# EAGLE board AQ_sensor_GSM (EAGLE 9.6.2), part 1 of 2
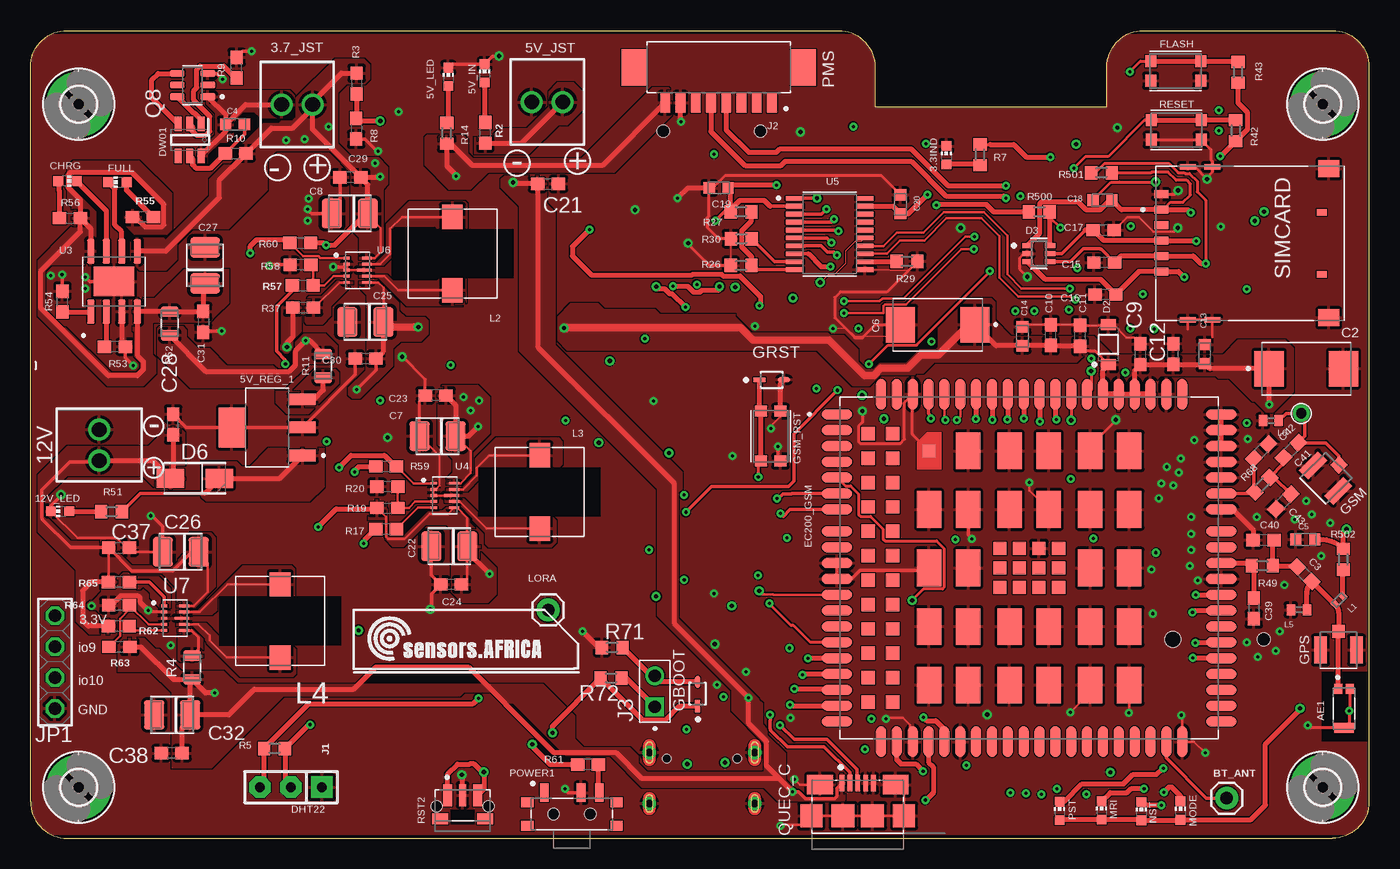
[diagram p8: board, top side]
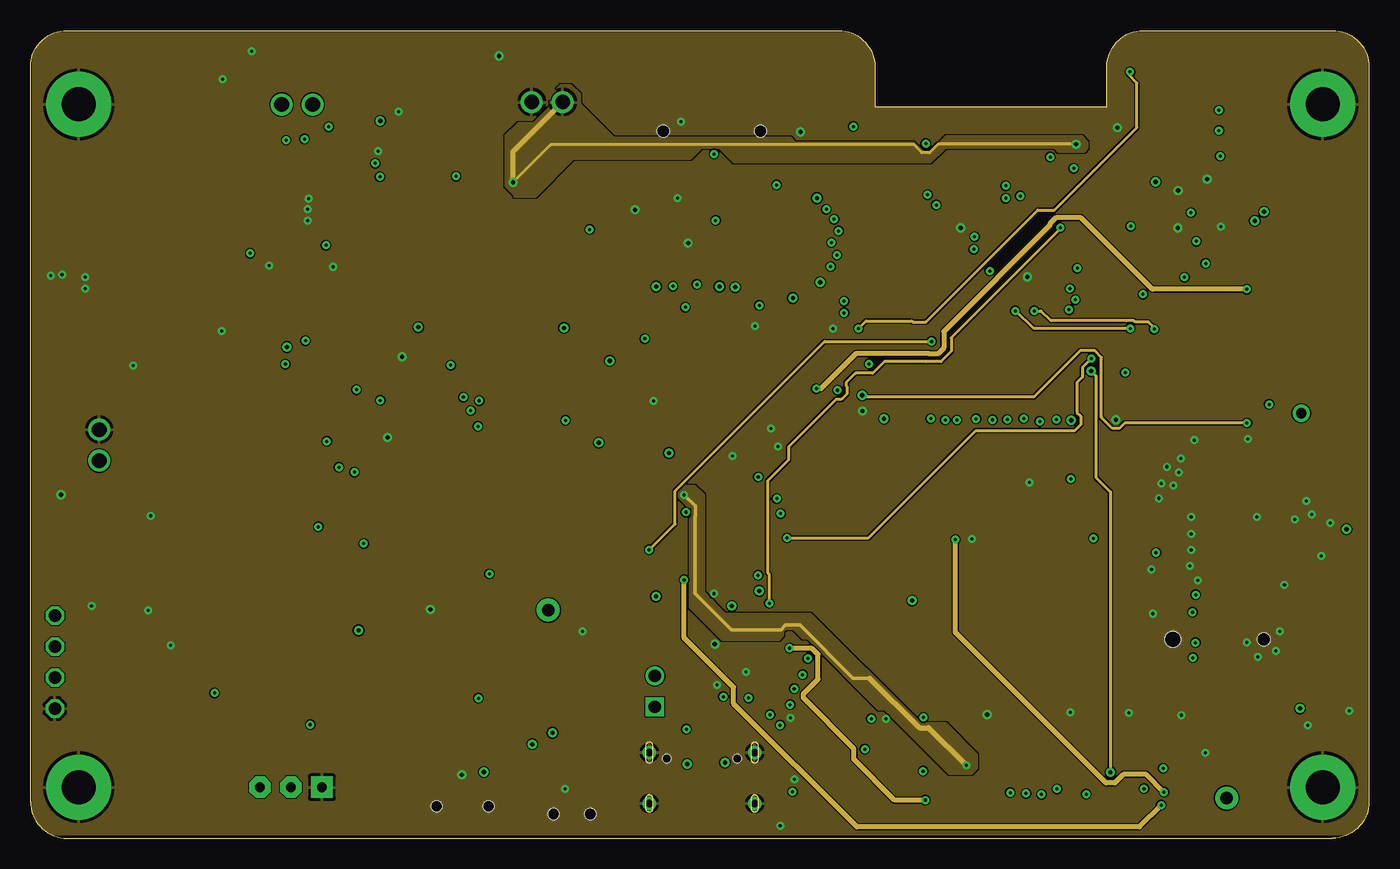
[diagram p9: board, inner layer GND]
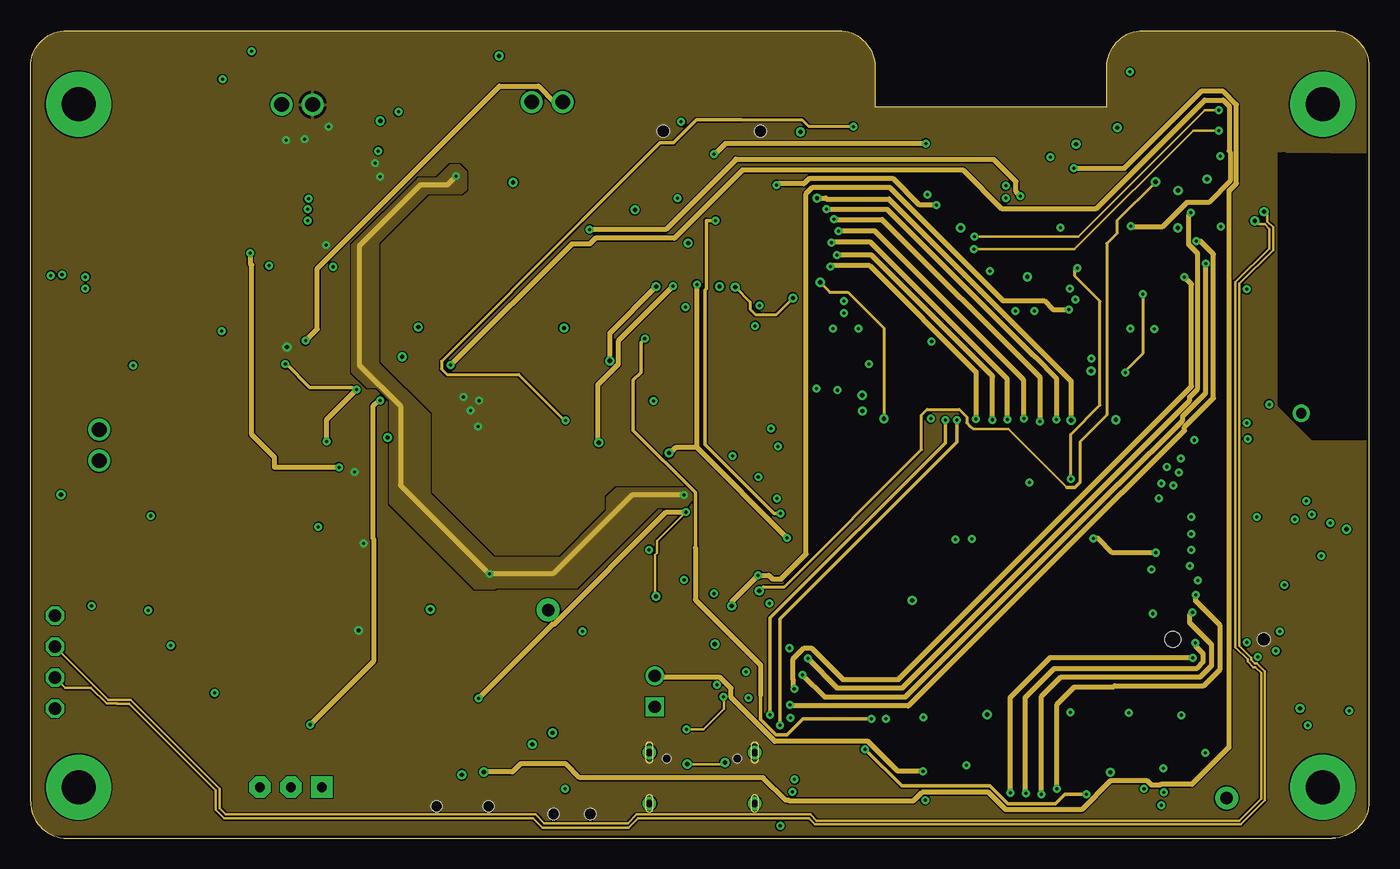
[diagram p10: board, inner layer V_LIPO]
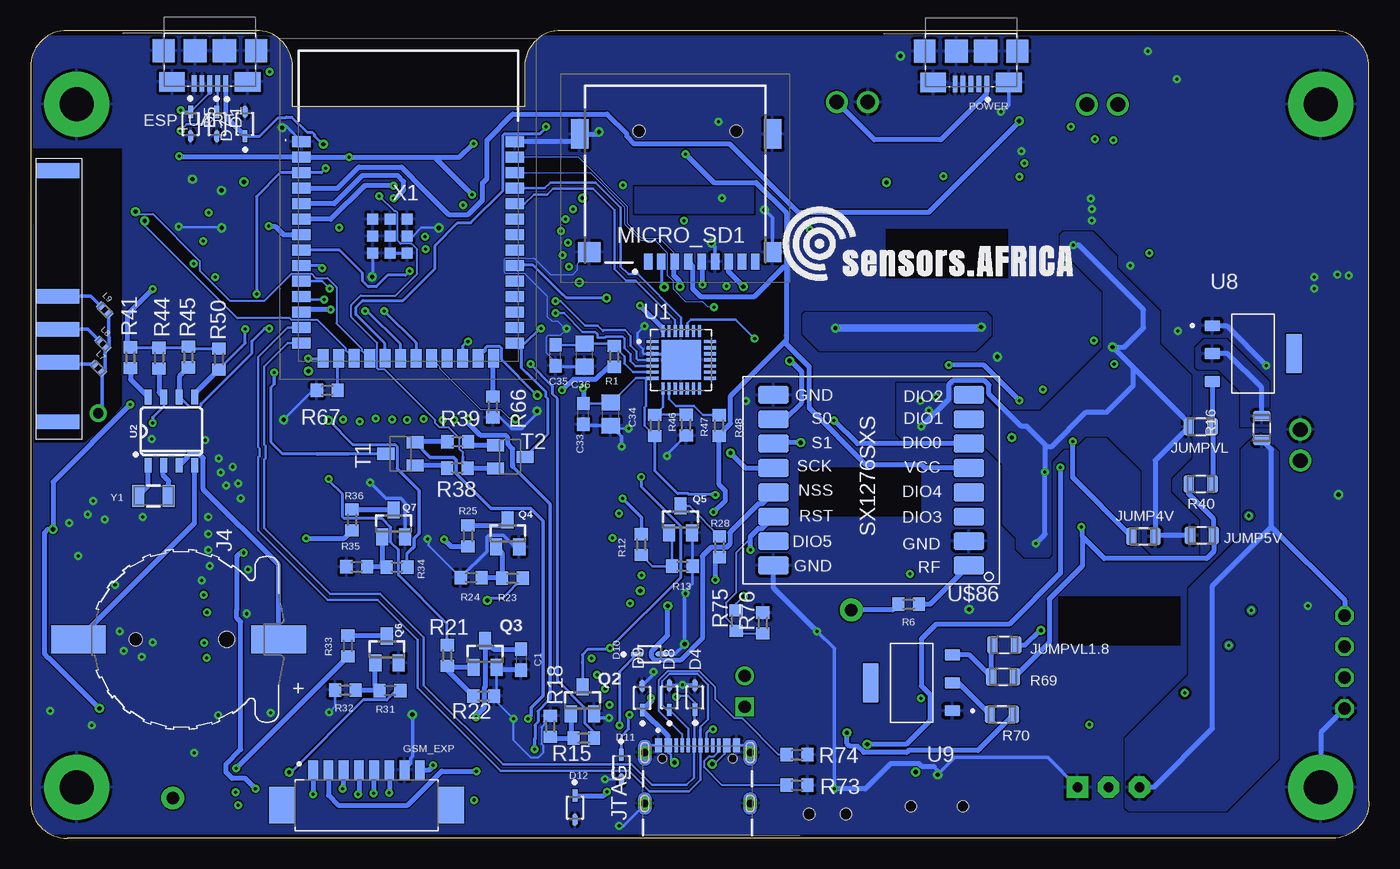
[diagram p11: board, bottom side, seen from below]

Size 109.75 x 66.25 mm. Coordinates in mm from the lower left corner, seen from the top.
Outline: 109.75,63.25 109.75,3 arc-90 106.75,0 3,0 arc-90 0,3 0,63.25 arc-90 3,66.25 66.25,66.25 arc-90 69.25,63.25 69.25,60 88.25,60 88.25,63.25 arc-90 91.25,66.25 106.75,66.25 arc-90 109.75,63.25
Copper layers (1+2*15+16): Top 0.035mm / dielectric 1.5mm / GND 0.035mm / dielectric 0.15mm / V_LIPO 0.035mm / dielectric 0.2mm / Bottom 0.035mm
Design rules "default *": minimum track width 0.1mm, minimum drill 0.15mm, track to track 0.1mm, track to pad 0.1mm, pad to pad 0.2mm, via to via 0.3mm, smd to smd 0.3mm, copper to edge 0.05mm, drill to drill 0.3mm, minimum pad ring 10mil, minimum via ring 8mil, stop-mask expansion 4mil, vias tented up to drill 0mil, thermal gap 10mil
Net classes: 0 default: width 0.1 mm, drill 0.2 mm, clearance 0.1 mm; 1 POWER: width 0.2 mm, drill 0.2 mm, clearance 0.2 mm to class 0, clearance 0.2 mm; 2 BGA: width 0.1 mm, drill 0.2 mm; 3 HCurrent: width 0.2 mm, drill 0.2 mm, clearance 0.2 mm to class 0; 4 Antenna: width 0.3 mm, drill 0.2 mm, clearance 0.3 mm to class 0

## Footprints (pad centres in the part's own frame; a part is rotated, then mirrored left to right if it is on the bottom)
CHIP-LED0603 = smd 0.8 x 0.8: A 0,-0.75; C 0,0.75
TERMBLK_254-2N = drill 1.2: 1 -1.27,0; 2 1.27,0
VREG_LM7805MPX/NOPB = smd 2.15 x 0.95: 1 -2.9,2.3; 2 -2.9,0; 3 -2.9,-2.3 | smd 2.15 x 3.25: 4 2.9,0
XDCR_W3011 = smd 0.65 x 0.8: 1 -0.475,1.6; 2 0.475,1.6 | smd 1.6 x 0.8: 3 0,-1.6
1X01 = drill 1.016 pad 1.88: 1 0,0
0603 = smd 1.1 x 1: 1 -0.85,0; 2 0.85,0
CAP_20TQC100MYF = smd 2.4 x 2.9: 1 -3.05,0; 2 3.05,0
CAPC1608X90N = smd 0.92 x 0.98: 1 -0.775,0; 2 0.775,0
CAP_TANT_B = smd 1.66 x 2.42: 1 -1.475,0; 2 1.475,0
C0603 = smd 1.1 x 1: 1 -0.85,0; 2 0.85,0
C0805 = smd 1.3 x 1.5: 1 -0.95,0; 2 0.95,0
ON_SEMI_1N4148WS_0 = smd 1.006 x 0.392: 1 -1,0; 2 1,0
ON_SEMICONDUCTOR_MMSZ5231BT1G_0 = smd 0.91 x 1.22: 1 -1.635,0; 2 1.635,0
SEMTECH_SMF05C_0 = smd 0.85 x 0.4: 1 -0.925,0.65; 2 -0.925,0; 3 -0.925,-0.65; 4 0.925,-0.65; 5 0.925,0; 6 0.925,0.65
DIOM5025X220N = smd 2.25 x 1.55: 1 -2,0; 2 2,0
SOT23-6L = smd 0.55 x 1.2: 1 -0.95,-1.3; 2 0,-1.3; 3 0.95,-1.3; 4 0.95,1.3; 5 0,1.3; 6 -0.95,1.3
XCVR_EC200UCNAB-N05-SNNSA = smd 2.5 x 0.8: 1 -15.75,12.6; 2 -15.75,11.3; 3 -15.75,10; 4 -15.75,8.7; 5 -15.75,7.4; 6 -15.75,6.1; 7 -15.75,4.8; 8 -15.75,0.4; 9 -15.75,-0.9; 10 -15.75,-2.2; 11 -15.75,-3.5; 12 -15.75,-4.8; 13 -15.75,-6.1; 14 -15.75,-7.4; 15 -15.75,-8.7; 16 -15.75,-10; 17 -15.75,-11.3; 18 -15.75,-12.6; 37 15.75,-12.6; 38 15.75,-11.3; 39 15.75,-10; 40 15.75,-8.7; 41 15.75,-7.4; 42 15.75,-6.1; 43 15.75,-4.8; 44 15.75,-3.5; 45 15.75,-2.2; 46 15.75,-0.9; 47 15.75,0.4; 48 15.75,4.8; 49 15.75,6.1; 50 15.75,7.4; 51 15.75,8.7; 52 15.75,10; 53 15.75,11.3; 54 15.75,12.6; 141 -15.75,3; 142 -15.75,1.7; 143 15.75,1.7; 144 15.75,3 | smd 0.8 x 2.5: 19 -9.55,-14.25; 20 -8.25,-14.25; 21 -6.95,-14.25; 22 -5.65,-14.25; 23 -4.35,-14.25; 24 -3.05,-14.25; 25 -1.75,-14.25; 26 -0.45,-14.25; 27 0.85,-14.25; 28 2.15,-14.25; 29 3.45,-14.25; 30 4.75,-14.25; 31 6.05,-14.25; 32 7.35,-14.25; 33 8.65,-14.25; 34 9.95,-14.25; 35 11.25,-14.25; 36 12.55,-14.25; 55 12.55,14.25; 56 11.25,14.25; 57 9.95,14.25; 58 8.65,14.25; 59 7.35,14.25; 60 6.05,14.25; 61 4.75,14.25; 62 3.45,14.25; 63 2.15,14.25; 64 0.85,14.25; 65 -0.45,14.25; 66 -1.75,14.25; 67 -3.05,14.25; 68 -4.35,14.25; 69 -5.65,14.25; 70 -6.95,14.25; 71 -8.25,14.25; 72 -9.55,14.25; 113 -10.85,14.25; 114 -12.15,14.25; 115 -10.85,-14.25; 116 -12.15,-14.25 | smd 1.1 x 1.1: 73 2.4,1.6; 74 2.4,0; 75 2.4,-1.6; 76 0.8,1.6; 77 0.8,0; 78 0.8,-1.6; 79 -0.8,1.6; 80 -0.8,0; 81 -0.8,-1.6; 82 -2.4,1.6; 83 -2.4,0; 84 -2.4,-1.6; 117 -11.2,11; 118 -11.2,9; 119 -11.2,7; 120 -11.2,5; 121 -11.2,3; 122 -11.2,1; 123 -11.2,-1; 124 -11.2,-3; 125 -11.2,-5; 126 -11.2,-7; 127 -11.2,-9; 128 -11.2,-11; 129 -13.2,11; 130 -13.2,9; 131 -13.2,7; 132 -13.2,5; 133 -13.2,3; 134 -13.2,1; 135 -13.2,-1; 136 -13.2,-3; 137 -13.2,-5; 138 -13.2,-7; 139 -13.2,-9; 140 -13.2,-11 | smd 2 x 3: 85 8.2,9.6; 86 8.2,4.8; 87 8.2,0; 88 8.2,-4.8; 89 8.2,-9.6; 90 5,9.6; 91 5,4.8; 92 5,0; 93 5,-4.8; 94 5,-9.6; 95 1.6,9.6; 96 1.6,4.8; 97 1.6,-4.8; 98 1.6,-9.6; 99 -1.6,9.6; 100 -1.6,4.8; 101 -1.6,-4.8; 102 -1.6,-9.6; 103 -5,9.6; 104 -5,4.8; 105 -5,0; 106 -5,-4.8; 107 -5,-9.6; 109 -8.2,4.8; 110 -8.2,0; 111 -8.2,-4.8; 112 -8.2,-9.6 | smd 1 x 1: 108 -8.2,9.6
AMPHENOL_10118192-0001LF = smd 0.4 x 1.35: 1 -1.3,0; 2 -0.65,0; 3 0,0; 4 0.65,0; 5 1.3,0 | smd 2.1 x 1.6: SH1 -3.1,-0.125; SH2 3.1,-0.125 | smd 1.8 x 1.9: SH3 -3.8,-2.675; SH6 3.8,-2.675 | smd 1.9 x 1.9: SH4 -1.2,-2.675; SH5 1.2,-2.675
SW_KMR621NGLFS = smd 0.9 x 1: 1_1 -2.05,0.8; 1_2 2.05,0.8; 2_1 -2.05,-0.8; 2_2 2.05,-0.8
TE_1909763-1 = smd 1 x 1.05: 1 0,-1.525 | smd 1.05 x 2.2: 2 -1.475,0; 3 1.475,0
MOLEX_53261-0871 = smd 0.8 x 1.6: 1 -4.375,2.9; 2 -3.125,2.9; 3 -1.875,2.9; 4 -0.625,2.9; 5 0.625,2.9; 6 1.875,2.9; 7 3.125,2.9; 8 4.375,2.9 | smd 2.1 x 3: S1 -6.925,0; S2 6.925,0
2,8-PAD = drill 2.8 pad 5.334: B2,8 0,0
SIP-100-03-32 = drill 0.813 pad 1.778 square: 1 -2.54,0 | drill 0.813 pad 1.778 octagon: 2 0,0; 3 2.54,0
CONNFLY_DS1021-1X2SF162-B = drill 1.02 square: 1 -1.27,0 | drill 1.02: 2 1.27,0
HARWIN_S8411-45R = smd 2.3 x 4.5: N 0,8.425; P 0,-7.975 | hole 1.05: 0,3.725 | hole 1.3: 0,-3.725
1X04 = drill 1.016 octagon: 1 -3.81,0; 2 -1.27,0; 3 1.27,0; 4 3.81,0
GCT_USB4105GFA120 = smd 0.6 x 1.15: A1_B12 -3.2,4.755; A4_B9 -2.4,4.755; B1_A12 3.2,4.755; B4_A9 2.4,4.755 | smd 0.3 x 1.15: A5 -1.25,4.755; A6 -0.25,4.755; A7 0.25,4.755; A8 1.25,4.755; B5 1.75,4.755; B6 0.75,4.755; B7 -0.75,4.755; B8 -1.75,4.755 | drill 0.6 pad 1: SH1 -4.32,4.18; SH2 4.32,4.18; SH3 -4.32,0; SH4 4.32,0 | hole 0.65: 2.89,3.68; -2.89,3.68
RES_0805 = smd 0.87 x 1.42: 1 -0.975,0; 2 0.975,0
INDC1005X60N = smd 0.51 x 0.63: 1 -0.46,0; 2 0.46,0
784778010 = smd 1.7 x 2: 1 0,3; 2 0,-3
INDC1005X45 = smd 0.7 x 0.9: 1 -0.65,0; 2 0.65,0
TF-01A = smd 0.7 x 1.3: 1 2.23,7.174; 2 1.13,7.174; 3 0.03,7.174; 4 -1.07,7.174; 5 -2.17,7.174; 6 -3.27,7.174; 7 -4.37,7.174; 8 -5.47,7.174; CD1 -6.57,7.174 | smd 1.448 x 1.651: MP1 -7.989,6.4 | smd 1.448 x 2.438: MP2 -7.989,-3.3; MP3 7.836,-3.3 | smd 1.854 x 1.651: MP4 7.061,6.4 | hole 1: -5.004,-3.531; 2.972,-3.531
SW_PCM12SMTR = smd 0.7 x 1.5: 1 -2.25,1.75; 2 0.75,1.75; 3 2.25,1.75 | smd 1 x 0.8: S1 -3.65,0.965; S2 -3.65,-0.965; S3 3.65,-0.965; S4 3.65,0.965 | hole 0.9: -1.5,0; 1.5,0
SOT23-BEC = smd 1 x 1.4: B -0.95,-1.1; C 0,1.1; E 0.95,-1.1
SOT95P280X145-6N = smd 1.21 x 0.59: 1 -1.255,0.95; 2 -1.255,0; 3 -1.255,-0.95; 4 1.255,-0.95; 5 1.255,0; 6 1.255,0.95
R0603 = smd 1 x 1.1: 1 -0.85,0; 2 0.85,0
SW_SKRTLAE010 = smd 0.75 x 1.8: 1 -1.225,0.9; 3 1.225,0.9 | smd 0.6 x 1.8: 2 0,0.9 | smd 1.3 x 0.9: S1 -1.85,-1.05; S2 1.85,-1.05 | hole 0.9: -2.125,0; 2.125,0
MOLEX_78646-3001 = smd 1.15 x 0.65: C1 -7.295,2.755; C2 -7.295,0.215; C3 -7.295,-2.325; C5 -7.295,4.025; C6 -7.295,1.485; C7 -7.295,-1.055 | smd 1.3 x 0.45: G1 -5.125,6.27; G2 -3.125,6.27; G3 -5.125,-6.27; G4 -3.125,-6.27 | smd 1.7 x 1.4: G5 6.435,-6.105; G6 6.435,6.105 | smd 0.8 x 0.54: X1 5.855,2.54; X2 5.855,-2.54
SC59-BEC = smd 1 x 1.4: B -0.95,-1.2; C 0,1.2; E 0.95,-1.2
QFN50P500X500X80-29N = smd 0.99 x 0.27: 1 -2.36,1.5; 2 -2.36,1; 3 -2.36,0.5; 4 -2.36,0; 5 -2.36,-0.5; 6 -2.36,-1; 7 -2.36,-1.5; 15 2.36,-1.5; 16 2.36,-1; 17 2.36,-0.5; 18 2.36,0; 19 2.36,0.5; 20 2.36,1; 21 2.36,1.5 | smd 0.27 x 0.99: 8 -1.5,-2.36; 9 -1,-2.36; 10 -0.5,-2.36; 11 0,-2.36; 12 0.5,-2.36; 13 1,-2.36; 14 1.5,-2.36; 22 1.5,2.36; 23 1,2.36; 24 0.5,2.36; 25 0,2.36; 26 -0.5,2.36; 27 -1,2.36; 28 -1.5,2.36 | smd 3.25 x 3.25: 29 0,0
SO08-0.15 = smd 0.6 x 1.2: 1 -1.905,-2.8; 2 -0.635,-2.8; 3 0.635,-2.8; 4 1.905,-2.8; 5 1.905,2.8; 6 0.635,2.8; 7 -0.635,2.8; 8 -1.905,2.8
SOP127P600X175-9N = smd 1.97 x 0.6: 1 -2.475,1.905; 2 -2.475,0.635; 3 -2.475,-0.635; 4 -2.475,-1.905; 5 2.475,-1.905; 6 2.475,-0.635; 7 2.475,0.635; 8 2.475,1.905 | smd 2.413 x 3.302: 9 0,0
VREG_TPS63802DLAR = smd 0.6 x 0.25: 1 -0.9,1; 2 -0.9,0.5; 3 -0.9,0; 4 -0.9,-0.5; 5 -0.9,-1 | smd 0.9 x 0.25: 6 0.75,-1; 7 0.75,-0.5; 9 0.75,0.5; 10 0.75,1 | smd 1.3 x 0.25: 8 0.55,0
SOP65P640X120-20N = smd 1.57 x 0.41: 1 -2.87,2.925; 2 -2.87,2.275; 3 -2.87,1.625; 4 -2.87,0.975; 5 -2.87,0.325; 6 -2.87,-0.325; 7 -2.87,-0.975; 8 -2.87,-1.625; 9 -2.87,-2.275; 10 -2.87,-2.925; 11 2.87,-2.925; 12 2.87,-2.275; 13 2.87,-1.625; 14 2.87,-0.975; 15 2.87,-0.325; 16 2.87,0.325; 17 2.87,0.975; 18 2.87,1.625; 19 2.87,2.275; 20 2.87,2.925
SOT229P700X180-4N = smd 1.31 x 0.93: 1 -3.345,2.29; 2 -3.345,0; 3 -3.345,-2.29 | smd 1.31 x 3.24: 4 3.345,0
SX1276SXS = smd 2.5 x 1.5: 1.RF 4.42,17.58; 2.GND 4.42,15.58; 3.DIO3 4.42,13.58; 4.DIO4 4.42,11.58; 5.VCC 4.42,9.58; 6.DIO0 4.42,7.58; 7.DIO1 4.42,5.58; 8.DIO2 4.42,3.58; 9.GND 20.42,3.58; 10.S0 20.42,5.58; 11.S1 20.42,7.58; 12.SCK 20.42,9.58; 13.NSS 20.42,11.58; 14.RST 20.42,13.58; 15.DIO5 20.42,15.58; 16.GND 20.42,17.58
GSM_SPRING_ANTENNA = drill 0.85 pad 1.422: 1 0,0
ADCH002_V1 = smd 1.2 x 3.5: 1 1,1.8; 2 11.3,1.8; 3 14,1.8; 4 16.7,1.8; 5 21.6,1.8
ESP32S3WROOM1N8R2 = smd 1.5 x 0.9: 1 -8.75,5.26; 2 -8.75,3.99; 3 -8.75,2.72; 4 -8.75,1.45; 5 -8.75,0.18; 6 -8.75,-1.09; 7 -8.75,-2.36; 8 -8.75,-3.63; 9 -8.75,-4.9; 10 -8.75,-6.17; 11 -8.75,-7.44; 12 -8.75,-8.71; 13 -8.75,-9.98; 14 -8.75,-11.25; 27 8.75,-11.25; 28 8.75,-9.98; 29 8.75,-8.71; 30 8.75,-7.44; 31 8.75,-6.17; 32 8.75,-4.9; 33 8.75,-3.63; 34 8.75,-2.36; 35 8.75,-1.09; 36 8.75,0.18; 37 8.75,1.45; 38 8.75,2.72; 39 8.75,3.99; 40 8.75,5.26 | smd 0.9 x 1.5: 15 -6.985,-12.5; 16 -5.715,-12.5; 17 -4.445,-12.5; 18 -3.175,-12.5; 19 -1.905,-12.5; 20 -0.635,-12.5; 21 0.635,-12.5; 22 1.905,-12.5; 23 3.175,-12.5; 24 4.445,-12.5; 25 5.715,-12.5; 26 6.985,-12.5 | smd 0.9 x 0.9: 41 -1.5,-2.46; 42 -1.5,-1.06; 43 -2.9,-1.06; 44 -2.9,-2.46; 45 -2.9,-3.86; 46 -1.5,-3.86; 47 -0.1,-3.86; 48 -0.1,-2.46; 49 -0.1,-1.06
CRYSTAL-SMD-3.2X1.5MM = smd 1 x 1.8: P$1 -1.25,0; P$2 1.25,0

## Placement (x,y rotation side)
3.3IND  ORANGE  [CHIP-LED0603]  75.09,56.02 0 top
3.7_JST  2828XX-2282834-2  [TERMBLK_254-2N]  21.86,60.17 0 top
5V_IN  ORANGE  [CHIP-LED0603]  37.24,62.73 0 top
5V_JST  2828XX-2282834-2  [TERMBLK_254-2N]  42.37,60.38 180 top
5V_LED  RED  [CHIP-LED0603]  34.25,62.44 0 top
5V_REG_1  LM7805MPX/NOPB  [VREG_LM7805MPX/NOPB]  19.41,33.69 180 top
12V  2828XX-2282834-2  [TERMBLK_254-2N]  5.63,32.24 90 top
12V_LED  RED  [CHIP-LED0603]  2.42,26.82 90 top
AE1  W3011  [XDCR_W3011]  107.7,10.65 0 top
BT_ANT  BTANT  [1X01]  98.07,3.3 180 top
C1  10nF  [0603]  69.53,14.65 270 bottom
C2  20TQC100MYF  [CAP_20TQC100MYF]  104.6,38.51 0 top
C3  100pF  [0603]  104.46,21.66 135 top
C4  100nf  [CAPC1608X90N]  16.77,58.54 180 top
C5  100nf  [CAPC1608X90N]  104.53,24.51 0 top
C6  20TQC100MYF  [CAP_20TQC100MYF]  74.38,42.12 180 top
C7  TAJB106K016RNJ  [CAP_TANT_B]  33.38,32.98 180 top
C8  TAJB106K016RNJ  [CAP_TANT_B]  26.18,51.24 180 top
C9  10pF  [C0603]  91.01,39.7 90 top
C10  33pF  [C0603]  83.66,41.28 90 top
C11  10pF  [C0603]  86.07,41.21 90 top
C12  33pF  [C0603]  93.7,39.71 90 top
C13  100nf  [CAPC1608X90N]  96.28,39.72 270 top
C14  100nf  [CAPC1608X90N]  81.33,41.17 270 top
C15  33pF  [C0603]  88.04,47.22 180 top
C16  33pF  [C0603]  88.14,44.6 180 top
C17  33pF  [C0603]  87.99,49.88 0 top
C18  100nf  [CAPC1608X90N]  87.9,52.35 0 top
C19  100nf  [CAPC1608X90N]  56.42,53.34 0 top
C20  100nf  [CAPC1608X90N]  71.33,52 270 top
C21  22pF  [C0603]  42.44,53.67 0 top
C22  TAJB106K016RNJ  [CAP_TANT_B]  34.34,23.95 180 top
C23  0.1uF  [C0603]  33.21,36.32 180 top
C24  0.1uF  [C0603]  34.49,20.82 180 top
C25  TAJB106K016RNJ  [CAP_TANT_B]  27.46,42.35 180 top
C26  TAJB106K016RNJ  [CAP_TANT_B]  12.32,23.49 180 top
C27  TAJB106K016RNJ  [CAP_TANT_B]  14.31,46.98 90 top
C28  22pF  [C0603]  11.69,33.93 90 top
C29  0.1uF  [C0603]  26.22,54.2 180 top
C30  0.1uF  [C0603]  27.48,39.33 180 top
C31  0.1uF  [C0603]  14.16,42.36 270 top
C32  TAJB106K016RNJ  [CAP_TANT_B]  11.61,10.12 180 top
C33  10uF  [C0603]  64.42,34.8 90 bottom
C34  100nF  [C0805]  62.17,34.78 90 bottom
C35  10uF  [C0603]  66.7,39.61 90 bottom
C36  100nF  [C0805]  64.32,39.63 90 bottom
C37  0.1uF  [C0603]  7.26,23.83 0 top
C38  0.1uF  [C0603]  11.57,6.98 180 top
C39  100pF  [0603]  100.3,18.85 270 top
C40  100pF  [0603]  101.1,24.45 180 top
C41  100pF  [0603]  103.34,31.84 225 top
C42  100pF  [0603]  100.9,31.75 45 top
C43  100pF  [0603]  102.73,27.62 225 top
CHRG  ORANGE  [CHIP-LED0603]  3.03,53.89 270 top
D1  ON_SEMI_1N4148WSON_SEMI_1N4148WS_0_0  [ON_SEMI_1N4148WS_0]  94.48,58.57 270 bottom
D2  ON_SEMICONDUCTOR_MMSZ5231BT1GON_SEMICONDUCTOR_MMSZ5231BT1G_0_0  [ON_SEMICONDUCTOR_MMSZ5231BT1G_0]  88.38,40.49 90 top
D3  SEMTECH_SMF05CSEMTECH_SMF05C_0_0  [SEMTECH_SMF05C_0]  82.67,47.95 0 top
D4  ON_SEMI_1N4148WSON_SEMI_1N4148WS_0_0  [ON_SEMI_1N4148WS_0]  55.27,11.55 90 bottom
D5  ON_SEMI_1N4148WSON_SEMI_1N4148WS_0_0  [ON_SEMI_1N4148WS_0]  96.62,58.57 270 bottom
D6  SS54-HF  [DIOM5025X220N]  13.48,29.51 180 top
D7  ON_SEMI_1N4148WSON_SEMI_1N4148WS_0_0  [ON_SEMI_1N4148WS_0]  92.16,58.58 90 bottom
D8  ON_SEMI_1N4148WSON_SEMI_1N4148WS_0_0  [ON_SEMI_1N4148WS_0]  57.37,11.54 90 bottom
D9  ON_SEMI_1N4148WSON_SEMI_1N4148WS_0_0  [ON_SEMI_1N4148WS_0]  59.59,11.51 90 bottom
D10  ON_SEMI_1N4148WSON_SEMI_1N4148WS_0_0  [ON_SEMI_1N4148WS_0]  59.01,15.11 0 bottom
D11  ON_SEMI_1N4148WSON_SEMI_1N4148WS_0_0  [ON_SEMI_1N4148WS_0]  61.31,5.85 270 bottom
D12  ON_SEMI_1N4148WSON_SEMI_1N4148WS_0_0  [ON_SEMI_1N4148WS_0]  65.1,2.5 270 bottom
DW01  DW01-P  [SOT23-6L]  13.05,57.27 180 top
EC200_GSM  EC200UCNAB-N05-SNNSA  [XCVR_EC200UCNAB-N05-SNNSA]  81.88,22.17 0 top
ESP_UART  10118192-0001LF  [AMPHENOL_10118192-0001LF]  95.04,61.9 180 bottom
FLASH  KMR621NGLFS  [SW_KMR621NGLFS]  93.89,62.93 0 top
FULL  ORANGE  [CHIP-LED0603]  7.13,53.81 90 top
GBOOT  ON_SEMI_1N4148WSON_SEMI_1N4148WS_0_0  [ON_SEMI_1N4148WS_0]  54.7,11.85 90 top
GPS  1909763-1  [TE_1909763-1]  107.25,15.44 180 top
GRST  ON_SEMI_1N4148WSON_SEMI_1N4148WS_0_0  [ON_SEMI_1N4148WS_0]  60.78,37.6 0 top
GSM  1909763-1  [TE_1909763-1]  106.2,29.54 135 top
GSM_EXP  53261-0871  [MOLEX_53261-0871]  82.19,2.71 0 bottom
GSM_RST  KMR621NGLFS  [SW_KMR621NGLFS]  60.7,32.98 270 top
H1  MOUNT-PAD-ROUND2.8  [2,8-PAD]  3.95,60.19 180 top
H2  MOUNT-PAD-ROUND2.8  [2,8-PAD]  3.95,4.19 180 top
H3  MOUNT-PAD-ROUND2.8  [2,8-PAD]  105.95,4.19 180 top
H4  MOUNT-PAD-ROUND2.8  [2,8-PAD]  105.95,60.19 180 top
J1  F-1X03-SIP-100-32  [SIP-100-03-32]  21.35,4.19 180 top
J2  53261-0871  [MOLEX_53261-0871]  56.42,63.23 180 top
J3  DS1021-1X2SF162-B  [CONNFLY_DS1021-1X2SF162-B]  51.2,12.05 90 top
J4  S8411-45R  [HARWIN_S8411-45R]  97.39,16.31 90 bottom
JP1  PINHD-1X4  [1X04]  2,14.45 270 top
JTAG  USB4105GFA120  [GCT_USB4105GFA120]  55.06,2.85 0 bottom
JUMP4V  0.4R  [RES_0805]  18.5,24.75 0 bottom
JUMP5V  0.4R  [RES_0805]  13.7,24.85 180 bottom
JUMPVL  0.4R  [RES_0805]  13.8,33.75 180 bottom
JUMPVL1.8  0.4R  [RES_0805]  29.9,15.85 0 bottom
L1  LQW15AN47NG00D  [INDC1005X60N]  107.29,19.52 45 top
L2  784778010  [784778010]  34.59,47.95 180 top
L3  784778010  [784778010]  41.75,28.4 180 top
L4  784778010  [784778010]  20.47,17.82 180 top
L5  LXES15AAA1-153  [INDC1005X45]  104,18.75 0 top
L6  LXES15AAA1-153  [INDC1005X45]  101.7,34.25 180 top
L7  4.3nH  [INDC1005X60N]  104.2,38.55 315 bottom
L8  2.2nH  [INDC1005X60N]  103.81,40.52 315 bottom
L9  22nH  [INDC1005X60N]  103.67,43.32 315 bottom
LORA  NA  [1X01]  42.45,18.72 0 top
MICRO_SD1  TF-01A  [TF-01A]  56.88,54.46 180 bottom
MODE  ORANGE  [CHIP-LED0603]  94.29,2.27 0 top
MRI  ORANGE  [CHIP-LED0603]  87.82,2.29 0 top
NST  ORANGE  [CHIP-LED0603]  91.08,2.22 0 top
POWER  10118192-0001LF  [AMPHENOL_10118192-0001LF]  32.63,61.86 180 bottom
POWER1  PCM12SMTR  [SW_PCM12SMTR]  44.39,1.99 0 top
PST  ORANGE  [CHIP-LED0603]  84.38,2.25 0 top
Q2  MMBT2222  [SOT23-BEC]  64.49,11.3 0 bottom
Q3  MMBT2222  [SOT23-BEC]  72.47,15.11 0 bottom
Q4  MMBT2222  [SOT23-BEC]  70.62,25 0 bottom
Q5  MMBT2222  [SOT23-BEC]  56.45,26.14 0 bottom
Q6  MMBT2222  [SOT23-BEC]  80.52,15.48 0 bottom
Q7  MMBT2222  [SOT23-BEC]  79.98,25.81 0 bottom
Q8  FS8205  [SOT95P280X145-6N]  13.29,61.77 180 top
QUEC_C  10118192-0001LF  [AMPHENOL_10118192-0001LF]  67.83,4.52 0 top
R1  0R  [R0603]  61.89,39.51 270 bottom
R2  1.20k  [0603]  37.3,57.86 90 top
R3  1.20k  [0603]  26.74,61.9 270 top
R4  0.4R  [RES_0805]  13.25,14 90 top
R5  4.7K  [R0603]  20.01,7.37 0 top
R6  0R  [R0603]  37.75,19.19 0 bottom
R7  200  [R0603]  77.85,56.05 90 top
R8  1.20k  [0603]  26.71,58.19 270 top
R9  1.20k  [0603]  16.91,63.2 90 top
R10  1.20k  [0603]  16.82,56.16 0 top
R11  0.4R  [RES_0805]  24,38.75 270 top
R12  4.7K  [R0603]  59.67,24.09 270 bottom
R13  47K  [R0603]  56.31,22.31 180 bottom
R14  1K  [R0603]  34.12,57.81 270 top
R15  4.7K  [R0603]  64.38,8.21 180 bottom
R16  0.4R  [RES_0805]  8.8,33.65 90 bottom
R17  100k  [0603]  29.15,25.35 180 top
R18  47K  [R0603]  67.12,9.18 270 bottom
R19  432k  [0603]  29.26,27.08 0 top
R20  47k  [0603]  29.26,28.83 180 top
R21  4.7K  [R0603]  75.57,14.99 270 bottom
R22  47K  [R0603]  72.59,11.67 180 bottom
R23  4.7K  [R0603]  70.24,21.33 180 bottom
R24  47K  [R0603]  73.62,21.38 0 bottom
R25  470R  [R0603]  73.88,24.8 270 bottom
R26  120K  [R0603]  58.27,46.98 180 top
R27  10K  [R0603]  58.27,51.38 0 top
R28  470R  [R0603]  53.26,23.91 270 bottom
R29  51K  [R0603]  71.88,47.32 0 top
R30  51K  [R0603]  58.28,49.17 180 top
R31  4.7K  [R0603]  80.28,12.11 180 bottom
R32  47K  [R0603]  83.93,12.17 0 bottom
R33  470R  [R0603]  83.74,15.77 270 bottom
R34  4.7K  [R0603]  79.71,22.23 180 bottom
R35  47K  [R0603]  83,22.26 0 bottom
R36  470R  [R0603]  83.39,26.11 270 bottom
R37  100k  [0603]  22.35,43.51 180 top
R38  10K  [R0603]  74.75,30.36 180 bottom
R39  10K  [R0603]  74.72,32.52 0 bottom
R40  0.4R  [RES_0805]  13.8,29.05 180 bottom
R41  0R  [R0603]  101.55,39.42 90 bottom
R42  10K  [R0603]  98.82,58.03 270 top
R43  10K  [R0603]  99,62.82 270 top
R44  47K  [R0603]  99.2,39.38 270 bottom
R45  47K  [R0603]  96.79,39.47 270 bottom
R46  20K  [R0603]  58.56,33.85 90 bottom
R47  47K  [R0603]  56,33.89 270 bottom
R48  10K  [R0603]  53.29,33.84 270 bottom
R49  0R  [R0603]  101,22.35 180 top
R50  47K  [R0603]  94.3,39.3 270 bottom
R51  1K  [R0603]  6.65,26.79 0 top
R52  0.4R  [RES_0805]  11.41,42.23 270 top
R53  1.2k  [0603]  6.92,40.31 180 top
R54  1k  [0603]  2.62,44.02 90 top
R55  1k  [0603]  9.22,50.95 180 top
R56  1k  [0603]  3.23,50.85 0 top
R57  330k  [0603]  22.32,45.34 0 top
R58  47k  [0603]  22.14,47.03 180 top
R59  1k  [0603]  29.16,30.49 180 top
R60  1k  [0603]  22.12,48.83 0 top
R61  10R  [0603]  45.72,6.04 180 top
R62  100k  [0603]  7.24,17.4 180 top
R63  432k  [0603]  7.29,15.69 180 top
R64  47k  [0603]  7.26,19.11 180 top
R65  1k  [0603]  7.26,21.01 180 top
R66  10K  [R0603]  71.84,35.38 270 bottom
R67  10K  [R0603]  85.42,36.73 180 bottom
R68  0R  [R0603]  101,28.99 225 top
R69  0.4R  [RES_0805]  30,13.25 0 bottom
R70  0.4R  [RES_0805]  30.1,10.15 180 bottom
R71  10K  [R0603]  47.7,15.65 0 top
R72  1K  [R0603]  47.6,13.15 180 top
R73  5k1  [R0603]  46.9,4.35 0 bottom
R74  5k1  [R0603]  46.9,6.85 180 bottom
R75  1K  [R0603]  51.9,17.85 90 bottom
R76  47K  [R0603]  49.7,17.65 90 bottom
R500  51K  [R0603]  82.71,51.37 180 top
R501  15k  [R0603]  87.82,54.59 0 top
R502  10R  [R0603]  107.64,22.89 90 top
RESET  KMR621NGLFS  [SW_KMR621NGLFS]  93.94,58.08 0 top
RST2  SKRTLAE010  [SW_SKRTLAE010]  35.43,2.63 0 top
SIMCARD  78646-3001  [MOLEX_78646-3001]  100.02,48.8 0 top
T1  S8050  [SC59-BEC]  79.41,31.53 90 bottom
T2  S8050  [SC59-BEC]  70.41,31.28 270 bottom
U1  CP2102N-A02-GQFN28  [QFN50P500X500X80-29N]  56.39,39.23 0 bottom
U2  DS1307Z  [SO08-0.15]  98.19,33.38 0 bottom
U3  TP4056  [SOP127P600X175-9N]  6.85,45.66 90 top
U4  TPS63802DLAR  [VREG_TPS63802DLAR]  33.97,28.11 0 top
U5  TXS0108EPWR  [SOP65P640X120-20N]  65.53,49.56 0 top
U6  TPS63802DLAR  [VREG_TPS63802DLAR]  26.82,46.59 0 top
U7  TPS63802DLAR  [VREG_TPS63802DLAR]  11.86,18.05 0 top
U8  AMS1117-3.3  [SOT229P700X180-4N]  9.5,39.75 0 bottom
U9  AMS1117-1.8  [SOT229P700X180-4N]  37.5,12.75 180 bottom
U$86  SX1276SXS  [SX1276SXS]  28.4,39.95 180 bottom
U$107  GSM_SPRING_ANTENNA  [GSM_SPRING_ANTENNA]  104.2,34.85 0 top
U$109  ADCH002_V1  [ADCH002_V1]  109.3,55.75 270 bottom
X1  ESP32-S3-WROOM-1-N16R8  [ESP32S3WROOM1N8R2]  78.78,51.85 0 bottom
Y1  32.768kHz  [CRYSTAL-SMD-3.2X1.5MM]  99.66,28.08 180 bottom

## Tracks (layer width: path | path; a pad name or v marks a point on that pad's centre or on a via)
1.8V  (via drill 0.35)
  Top 0.406: 54.63,10.78 GBOOT.1 53.23,10.85 52.09,9.71 50.19,9.71 R72.2 42.8,9.2 v42.8,8.65
  Bottom 0.406: R70.1 32.07,7.21 37.73,7.21 37.9,7.03 41.42,7.03 41.94,7.55 42.6,7.55 42.8,7.75 v42.8,8.65
4.0V_OUT  (via drill 0.25, 0.35)
  Top 0.2: U6.6 28.52,45.59 28.94,45.18 28.94,42.38 C25.1
  Top 0.254: C11.1 86.43,39.99 87.26,39.99 88.39,38.87 D2.1
  Top 0.305: R57.1 21.47,44.89 20.19,43.61 20.19,39.95 20.9,39.24 v20.9,38.88 | v26.74,36.79 28.33,38.39 C30.1
  Top 0.406: C11.1 83.73,40.36 C10.1 83.63,40.4 C14.2 79.16,40.4 C6.1 | EC200_GSM.57 EC200_GSM.58 | D2.1 87.93,38.4 EC200_GSM.60 EC200_GSM.59 EC200_GSM.58 | C30.1 28.94,39.94 C25.1 | PST.A 84.41,1.54 MRI.A 91.01,1.54 NST.A 94.23,1.47 MODE.A 100.07,1.52 101.26,2.71 101.26,7.71 104.2,10.65 v104.1,10.65 | v101.56,35.59 C2.1 96.71,38.51 C13.2 96.19,38.86 C12.1 | C12.1 | C12.1 91.02,38.86 C9.1 90.53,38.38 EC200_GSM.58 | C5.2 105.81,24.51 arc-45 107.61,23.77 R502.2 107.64,25.09 v107.9,25.35
  Top 0.61: C6.1 76.94,42.12 74.43,39.62 73,39.62 71.94,38.55 69.73,38.55 69.15,37.97 68.38,37.97 65.47,40.88 59.24,40.88 58.22,41.9 44.01,41.9 43.85,41.74 v43.74,41.85 | v31.79,41.92 29.39,41.92 28.94,42.38
  V_LIPO 0.305: v26.74,36.79 26.64,36.69 26.36,36.97 22.9,36.97 20.99,38.88 v20.9,38.88
  V_LIPO 0.406: v24.3,32.55 24.3,34.35 v26.74,36.79
  Bottom 0.406: JUMP4V.1 24.3,29.57 v24.3,32.55 | v104.1,10.65 108.21,14.76 108.23,14.76 108.6,15.13 108.6,25.05 108.3,25.35 v107.9,25.35 107.9,29.24 v101.56,35.59
  Bottom 0.61: v43.74,41.85 31.77,41.85 31.75,41.88 v31.79,41.92
  pour Top: 27.6,44.55 27,45.15 27,45.65 28.5,45.65 30.2,43.95 30.2,43.25 30.7,42.75 32.3,42.75 32.6,42.45 32.6,41.35 32,40.75 30.3,40.75 29.7,40.15 29.7,38.75 27,36.05 26.4,36.05 26.1,36.35 26.1,36.95 27.5,38.35 27.5,39.45 27.6,39.55
  pour Bottom: 33.7,43.15 31.4,43.15 31,42.75 31,41.25 31.7,40.55 32.3,39.95 45,39.95 46.4,41.35 46.4,42.95 46.2,43.15
  pour Top: 46.52,43.85 44.3,43.85 43.2,42.75 43.2,40.85 44,40.05 64.5,40.05 67.4,37.15 68.8,37.15 69.7,38.05 72.5,38.05 72.6,38.15 73.2,38.15 74.1,39.05 85.8,39.05 86.6,39.85 87.3,39.85 87.7,39.45 87.7,35.45 88.1,35.05 92.1,35.05 92.3,35.25 92.3,37.55 92.7,37.95 97.2,37.95 97.4,37.75 98.3,37.75 100.2,35.85 100.4,35.85 101.3,34.95 101.9,34.95 103.6,36.65 103.6,40.15 102.9,40.85 99,40.85 97.8,39.65 88.7,39.65 87.2,41.15 80.4,41.15 79.1,42.45 79.1,43.95 78.8,44.25 75.7,44.25 74.4,42.95 74.4,40.25 74.2,40.05 72.9,40.05 71.8,38.95 69.6,38.95 69.1,38.45 68.5,38.45 67.9,39.05 67.9,40.05 66.7,41.25 65.6,41.25 65.4,41.45 59.1,41.45 57.8,42.75 57.8,42.95 51.6,42.95 51.19,43.36 47.01,43.36
5V_OUT  (via drill 0.25)
  Top 0.2: C24.1 35.82,21.3 35.82,23.92 C22.1 35.82,26.28 34.98,27.11 U4.6 34.22,26.61 32.74,26.61 30.68,24.55 29.33,24.55 29.15,24.73 29.15,26.34 28.47,27.02 R19.1
  Top 0.406: v34.9,54.3 34.94,54.34 34.12,55.16 R14.2 34.45,56.96 36.24,55.17 46.89,55.17 J2.8 | v37.63,21.68 35.82,23.5 35.82,23.92 | v23.6,25.55 25.07,27.02 28.47,27.02
  GND 0.305: 68.81,13.13 67.46,13.13 63.11,17.48 61.91,17.48 61.53,17.1 57.48,17.1 54.5,20.09 54.5,26.41 54.51,26.42 54.51,27.24 v53.6,28.15
  GND 0.406: v76.73,5.97 73.63,9.07 72.87,9.07 68.81,13.13 | v99.73,45.03 91.99,45.03 86.11,50.9 84.09,50.9 83.6,50.41 83.6,50.3 74.88,41.57 74.88,40.21 74.39,39.72 73.7,39.72 73.69,39.73 67.68,39.73 64.82,36.87 v64.44,36.87
  V_LIPO 0.406: v34.9,54.3 34.17,53.57 31.95,53.57 26.96,48.58 26.96,38.81 30.33,35.45 30.33,28.95 37.59,21.68 v37.63,21.68 42.83,21.68 49.3,28.15 v53.6,28.15
  Bottom 0.2: C33.2 62.25,35.65 C34.2 62.1,35.73 60.1,37.73 59.27,37.73 | 59.27,37.73 U1.7 | 59.27,37.73 59.27,35.47 59.41,35.33 59.41,33.85 R46.1
  Bottom 0.254: R41.2 101.51,40.23 R44.1 96.88,40.23 R45.1 96.62,40.15 R50.1 | 53.81,28.21 55.76,28.21 55.81,28.27 56.7,28.27 58.56,30.13 R46.1
  Bottom 0.406: 53.66,28.21 53.81,28.21 53.75,28.15 v53.6,28.15 | GSM_EXP.8 77.03,5.61 76.7,5.94 v76.73,5.97 | R41.2 101.81,40.54 101.81,42.94 v99.73,45.03 | v64.44,36.87 64.42,36.85 C33.2 | R40.2 14.78,28.23 12.72,26.18 JUMP5V.1 12.72,23.52 13.3,22.95 21.7,22.95 23.5,24.75 | v23.6,25.55 23.5,25.55 23.5,24.75 | 23.5,24.75 23.5,22.35 26.22,19.63 26.22,16.06 R69.2
  pour Top: 29.2,27.05 29.2,27.55 29,27.75 27.7,27.75 27.7,26.15 29,26.15 29.1,26.05 29.1,24.55 29.7,23.95 30.6,23.95 32.4,25.75 34.1,25.75 34.5,25.35 34.5,20.25 35.4,19.35 37.5,19.35 38.2,20.05 38.2,22.15 36.9,23.45 36.9,24.95 36,25.85 36,26.15 35,27.15 34.1,27.15 33.8,26.85 33.6,26.85 33.5,26.75 32.6,26.75 30.6,24.75 29.3,24.75 29.3,26.95
  pour V_LIPO: 39.7,23.05 37.9,23.05 37,22.15 37,20.75 37.2,20.55 44.8,20.55 51.4,27.15 53.7,27.15 54.4,27.85 54.4,28.15 53.8,28.75 48,28.75 47.2,27.95 47.2,26.85 46.7,26.35 43.4,23.05
  pour V_LIPO: 36.4,20.45 38.1,20.45 38.7,21.05 38.7,22.35 37.6,23.45 32.8,28.25 32.8,34.75 28.6,38.95 28.6,44.05 28.6,48.85 32.4,52.65 32.6,52.85 35.4,52.85 35.8,53.25 35.8,54.65 35.2,55.25 34.6,55.25 34.4,55.25 33.3,54.15 31.8,54.15 31.6,53.95 26.3,48.65 26.3,38.25 27.6,36.95 28.4,36.95 29.4,35.95 29.4,33.95 29.4,27.45
  pour Top: 32.3,57.45 32.3,55.25 34.3,53.25 36.1,53.25 37.5,54.65 47.9,54.65 52.6,59.35 52.6,61.25 52.3,61.55 51,61.55 45.2,55.75 36.3,55.75 35.9,56.15 35.9,57.25 35.5,57.65 32.5,57.65
  pour GND: 54.5,28.95 53.5,28.95 53,28.45 53,28.05 53.7,27.35 53.9,27.15 54.2,27.15 54.2,26.35 54,26.15 54,18.95 56.3,16.65 56.7,16.25 61.4,16.25 61.8,16.65 61.8,16.95 62,17.15 62.5,17.15 63.3,16.35 63.7,16.35 69.5,10.55 70,10.55 75.3,5.25 77.2,5.25 77.7,5.75 77.7,6.85 75.1,9.45 73,9.45 64,18.45 61.2,18.45 57,18.45 55.3,20.15 55.3,28.15
12V-IN
  Top 0.2: R65.2 6.41,20.59 | 6.39,17.66 R62.2 | R65.2 C37.1 6.64,23.83 | 13.78,23.51 C26.1 | U7.10 13.38,19.05 14.53,20.2 14.53,22.56 13.78,23.31
  Top 0.305: 13.78,23.51 13.78,23.31 13.06,23.31 11.68,21.93 8.31,21.93 C37.1 3.29,23.83 0.98,26.14 0.98,26.22 0.92,26.28 0.92,28.57 3.22,30.87 5.53,30.87 12V.1
  Top 0.406: C28.1 11.69,29.72 D6.2 10.02,30.97 12V.1 | R65.2 4.96,21.01 4.27,20.32 4.27,17.88 4.75,17.4 R62.2
  pour Top: 13.5,18.95 15.2,20.65 15.2,24.65 14.8,25.05 13.1,25.05 12.6,24.55 12.6,23.35 12.1,22.85 12.1,22.65 11.8,22.35 8.3,22.35 7,23.65 7,24.35 3.3,24.35 1.5,26.15 1.3,26.15 1.1,26.35 1.1,27.85 3,29.75 9.2,29.75 10.3,28.65 12.5,28.65 12.7,28.85 12.7,33.25 12.2,33.75 11.3,33.75 9.7,32.15 3,32.15 0.6,29.75 0.6,25.15 3.7,22.05 3.7,17.85 4.8,16.75 7,16.75 7,17.95 5.9,17.95 5.3,18.55 4.8,18.55 4.5,18.85 4.5,19.35 4.8,19.65 5,19.65 5.9,20.55 7.1,20.55 7.1,21.55 7.5,21.95 8.1,21.95 8.3,21.75 10.8,21.75 12,20.55 12,18.95
34GHB
  cutout Top: 105.9,8.05 105.9,13.65 110,13.65 110,7.95 105.9,7.95
+3V3  (via drill 0.25, 0.35)
  Top 0.254: R7.2 78.68,56.9
  Top 0.305: v53.73,26.74 55.84,28.85 62.15,28.85 62.6,29.31 62.6,33.17 v66.17,36.74
  Top 0.406: U5.19 70.72,51.84 C20.2 71.97,51.22 73.54,52.79 v73.55,52.78 | R43.2 99,60.32 99.77,59.55 99.77,58.13 R42.2 97.58,55.94 v97.54,55.94 | J1.3 19.16,4.54 R5.1 22.82,11.03 36.27,11.03 v36.73,11.49 | 78.68,56.9 80.62,56.9 81.65,55.88 v83.61,55.88
  V_LIPO 0.2: v53.73,26.74 51.36,24.37 51.36,23.4 51.2,23.24 51.2,19.85 51.22,19.83 v51.28,19.83
  V_LIPO 0.406: v73.4,56.98 56.97,56.98 56.07,56.08 v56.04,56.11 | v36.73,11.49 42.8,17.56 42.94,17.56 52.12,26.74 v53.73,26.74
  Bottom 0.2: v51.28,19.83 51.9,19.21 R75.2
  Bottom 0.406: R1.2 62.37,38.66 63.41,37.63 65.23,37.63 66.11,36.74 v66.17,36.74 | v53.73,26.74 52.77,27.7 52.77,28.5 53.29,29.02 R48.2 53.29,33.07 52.34,34.03 52.34,36.28 47.77,40.85 | v97.54,55.94 97.54,55.84 X1.2 83.64,55.84 | 83.64,55.84 v83.61,55.88 | v73.55,52.78 76.61,55.84 | 83.64,55.84 76.61,55.84 | 76.61,55.84 74.6,55.84 73.43,57.01 v73.4,56.98 | v56.04,56.11 53.72,53.79 50.24,53.79 47.77,51.31 47.77,46.87 | 47.77,46.87 47.77,41.25 47.77,40.85 | MICRO_SD1.4 55.47,46.94 55.47,45.08 54.83,44.44 50.4,44.44 47.97,46.87 47.77,46.87 | J1.3 17.66,4.19 12.85,9.01 12.85,20.7 8,25.55 | 8,25.55 8,31.88 R16.1 | 8,25.55 2,19.55 JP1.1 | U$86.5.VCC 36.43,30.37 36.67,30.61 41.23,30.61 45.89,35.27 45.89,38.65 47.77,40.52 47.77,40.85
  pour Bottom: 7.4,31.65 9.05,33.3 10.5,31.85 10.5,24.75 14.8,20.45 14.8,13.35 20,8.15 20,2.55 19.7,2.25 11.7,2.25 7.4,6.55
BATT-
  Top 0.406: C4.2 17.63,60.17 3.7_JST.1 | Q8.1 16,59.37 C4.2 | C4.2 16,57.97 DW01.6
  pour Top: 14,61.15 14.2,61.35 21.2,61.35 21.6,60.95 21.6,59.35 21.3,59.05 20.3,59.05 18.9,59.05 18.4,59.55 17.4,59.55 17,59.15 16.6,58.75 16.6,57.55 16.1,57.05 15.5,57.05 14.5,56.05 14.5,55.35 13.7,55.35 13.7,56.65 13.8,56.75 13.9,56.85 14.4,56.85 15.2,57.65 15.2,59.35 15.2,59.45 14.4,60.25 14,60.65
BMSV  (via drill 0.35)
  Top 0.406: R3.2 26.74,59.07 | 26.74,59.07 R8.1 | v28.68,58.83 26.98,58.83 26.74,59.07
  Bottom 0.406: X1.4 84.58,53.3 82.83,55.05 79.33,55.05 78.44,54.15 78.44,54.12 75.43,51.11 73.92,51.11 72.72,52.31 72.72,53.7 72.33,54.09 72.33,57.26 70.2,59.39 62.47,59.39 60.86,57.78 60.86,57.58 60.22,56.95 52.4,56.95 46.81,51.35 36.1,51.35 28.68,58.78 v28.68,58.83
BOOST_EN  (via drill 0.25, 0.35)
  Top 0.2: 21.37,48.74 22.37,47.73 23.62,47.73 23.77,47.59 U6.1 | 21.32,48.79 R60.1 | R59.1 31.39,29.11 U4.1
  Top 0.406: 21.27,48.49 R60.1 | R59.1 29.93,30.49 29.03,31.4 26.28,31.4 v25.3,30.42 | 21.37,48.74 21.32,48.79 21.01,49.09 18.54,49.09 18.01,48.56 v18.01,47.98 | R61.2 42.64,6.04 41.14,7.55 v41.14,7.71
  V_LIPO 0.406: v25.3,30.42 20.01,30.42 20.01,31.25 18.14,33.12 18.14,47.02 18.01,47.14 v18.01,47.98
  Bottom 0.406: v25.3,30.42 25.3,21.75 29.5,17.55 35.5,17.55 36.7,16.35 36.7,12.5 36,11.8 36,9.65 37.94,7.71 v41.14,7.71
  pour Top: 10.6,18.95 11.5,18.95 11.5,20.45 10.5,21.45 7.5,21.45 7.5,20.45 9,20.45 9.2,20.65 9.3,20.65 9.8,20.15 9.8,19.75
BT_ANT
  Top 0.3: EC200_GSM.35 93.13,6.58 96.42,3.3 BT_ANT.1
DHT_OUT  (via drill 0.25)
  Top 0.406: J1.2 20.86,4.68 R5.2 22.81,9.32 v22.93,9.32
  V_LIPO 0.406: v22.93,9.32 28.16,14.55 28.16,24.51 28.1,24.57 28.1,35.48 28.53,35.91 v28.68,35.91 | v90.22,50.2 90.28,50.13 92.79,50.13 94.8,52.15 96.6,52.15 98.37,53.92 98.37,56.29 98.28,56.38 98.28,60.06 97.79,60.55 96.28,60.55 87.39,51.65 79.63,51.65 76.48,54.8 58.37,54.8 52.79,49.22 46.31,49.22 45.84,48.75 44.4,48.75 v34.45,38.8
  Bottom 0.406: v28.68,35.91 31.57,38.8 v34.45,38.8 | v90.22,50.2 89.71,50.2 89,49.49 X1.7
DIO0  (via drill 0.25)
  V_LIPO 0.254: v67.47,58.36 63.83,58.36 63.27,58.92 58.28,58.92 | 45.26,50.68 33.7,39.12 33.7,38.49 34.14,38.05 40.03,38.05 43.8,34.28 v43.87,34.28
  V_LIPO 0.305: 45.26,50.68 51.62,57.04 52.73,57.04 54.6,58.92 58.28,58.92
  Bottom 0.254: X1.19 80.69,40.57 83.05,42.93 83.05,43.56 82.5,44.12 79.21,44.12 76.59,46.74 76.59,48.61 74.71,50.48 73.66,50.48 71.01,53.13 71.01,57.66 70.88,57.79 67.98,57.79 67.44,58.34 v67.47,58.36
  Bottom 0.406: U$86.6.DIO0 41.96,32.37 v43.87,34.28
DTR  (via drill 0.25)
  Top 0.406: v45.84,49.93 44.44,48.53 44.44,47.76 45.99,46.21 54.24,46.21 54.29,46.26 56.66,46.26 56.79,46.13 58.19,46.13 59.88,44.44 59.88,43.81 v59.76,43.7
  V_LIPO 0.406: v81.16,52.68 80.8,53.03 80.8,53.86 78.99,55.67 57.85,55.67 | 57.81,55.71 57.85,55.67 | 57.85,55.67 52.1,49.93 v45.84,49.93
  Bottom 0.15: v81.16,52.68 79.89,51.42 79.76,51.42 79.66,51.32 79.66,49.02 79.41,48.77 78.51,48.77 78.05,48.31 78.05,46.27 79.81,44.52 82.66,44.52 83.45,43.73 83.45,42.77 81.31,40.62 81.31,38.53 81.21,38.43 80.7,38.43 76.56,34.29 76.56,34.05 76.21,33.7 75.45,33.7 74.55,32.8 74.55,31.9 74.27,31.62 74.27,31.26
  Bottom 0.254: 74.27,31.26 74.27,30.73 73.87,30.33
  Bottom 0.406: T2.E 73.87,30.33 R38.1 | v59.76,43.7 57.89,41.83 U1.28
ESP_RST  (via drill 0.25, 0.35)
  Top 0.254: RESET.1_1 91.34,58.88 88.37,55.92 86.5,55.92 v85.53,54.95
  Top 0.406: R42.1 RESET.1_2 RESET.1_1 | RST2.3 37.18,4.05 v37.18,5.44 37.02,5.44 36.36,6.1 36.02,6.1 36.01,6.09 35.01,6.09 34.21,5.29 RST2.1
  V_LIPO 0.254: v91.22,44.61 91.22,39.77 89.6,38.15 89.72,38.15 v89.76,38.2
  V_LIPO 0.406: v85.53,54.95 89.69,54.95 95.99,61.25 97.8,61.25 98.88,60.17 98.88,53.71 98.26,53.09 98.26,7.45 95.23,4.42 92.67,4.42 92.6,4.35 91.92,4.35 91.57,4.71 88.54,4.71 86.19,2.36 79.97,2.36 78.56,3.77 73.1,3.77 72.42,3.08 62.19,3.08 62.12,3.15 61.9,3.15 60.07,4.98 45.03,4.98 43.9,6.11 40.18,6.11 39.52,5.44 v37.18,5.44
  Bottom 0.254: v85.53,54.95 85.91,54.57 X1.3 89.28,54.57 91.22,52.63 v91.22,44.61 | T1.C 83.71,31.53 | 86.27,31.53 89.07,31.53 90.06,32.52 90.06,36.98 89.76,37.27
  Bottom 0.305: 83.71,31.53 86.27,31.53 | v89.76,38.2 89.76,37.27
ESP_RX
  Bottom 0.2: U1.26 56.89,42.49 60.16,45.75 60.93,45.75 61.85,46.68 61.85,51.52 63.61,53.28 66.91,53.28 67.39,52.8 68.46,52.8 69.23,52.03 X1.36
ESP_TX
  Bottom 0.2: U1.25 56.39,42.7 59.95,46.25 60.72,46.25 61.35,46.88 61.35,51.73 63.4,53.78 67.12,53.78 67.6,53.3 X1.37
EUART_N  (via drill 0.25)
  Top 0.2: v66.71,43.08 69.93,43.08 69.93,43.66 70.05,43.77 71.8,43.77 76.33,48.3 v77.34,48.3
  V_LIPO 0.2: v77.34,48.3 85.6,48.3 95.35,58.05 v97.45,58.05
  Bottom 0.2: ESP_UART.2 94.39,59.66 D1.1 94.48,59.26 95.17,58.57 96.92,58.57 v97.45,58.05 | v66.71,43.08 66.02,43.08 64.47,41.53 63.45,41.53 63.27,41.36 63.27,41.08 62.65,41.08 62.57,41.16 61.22,41.16 61.04,40.99 61.04,40.22 60.54,39.72 60.54,39.13 60.14,38.73 U1.5
EUART_P  (via drill 0.25)
  Top 0.2: v66.71,44.04 69.61,44.04 69.84,44.27 71.59,44.27 76.66,49.34 v77.41,49.34
  V_LIPO 0.2: v77.41,49.34 85.93,49.34 96.3,59.71 v97.45,59.71
  Bottom 0.2: 95.04,61.15 D5.1 97.31,59.57 v97.45,59.71 | v66.71,44.04 66.27,44.04 64.26,42.03 63.24,42.03 62.82,41.62 62.77,41.66 61.01,41.66 60.54,41.2 60.54,40.43 60.04,39.93 60.04,39.34 59.94,39.23 U1.4
  Bottom 0.406: ESP_UART.3 95.04,61.15
EUSB_N
  Bottom 0.2: X1.13 88.68,41.87 91.08,39.47 91.08,32.09 90.96,31.98 90.96,31.37 91.08,31.25 91.08,25.24 85.4,19.55 81.28,19.55 78,16.27 78,12.34 71.22,5.55 60.67,5.55 58.99,3.87 55.74,3.87 54.81,4.81 JTAG.A7 | 57.37,10.85 D8.1 55.81,8.98 JTAG.B7 | 54.81,8.94 54.81,9.13 54.18,9.76 54.18,12.58 55.06,13.47 57.36,13.47 57.97,12.85 57.97,10.96 57.62,10.61
  Bottom 0.254: D8.1 57.37,10.36 | 57.37,10.36 57.37,10.18 | JTAG.A7 54.81,8.94 | 57.62,10.61 57.37,10.36
EUSB_P  (via drill 0.25)
  V_LIPO 0.2: v53.78,8.94 55.18,8.94 56.87,10.63 56.87,11.24 56.82,11.29 v56.82,11.61
  Bottom 0.2: X1.14 88.68,40.6 90.58,38.7 90.58,32.3 90.46,32.18 90.46,31.16 90.58,31.05 90.58,25.44 85.19,20.05 81.08,20.05 77.5,16.48 77.5,12.54 71.01,6.05 60.47,6.05 58.78,4.37 55.95,4.37 55.36,4.96 55.36,7.56 JTAG.A6 55.31,10.51 | JTAG.B6 54.31,8.63 54,8.94 v53.78,8.94 | v56.82,11.61 56.77,11.66 55.84,11.66 55.27,11.1 D4.1
  Bottom 0.254: 55.31,10.51 D4.1
G_ADC0  (via drill 0.25)
  Top 0.406: v95.54,19.96 95.55,19.97 EC200_GSM.45
  V_LIPO 0.406: v84.16,4.05 84.16,10.98 85.58,12.4 88.78,12.4 88.9,12.52 96.2,12.52 97.56,13.87 97.56,17.45 95.54,19.46 v95.54,19.96
  Bottom 0.406: GSM_EXP.3 84.1,5.58 84.1,4.11 v84.16,4.05
G_ADC1  (via drill 0.25)
  Top 0.406: v95.28,18.54 95.41,18.67 EC200_GSM.44
  V_LIPO 0.406: v82.9,3.59 82.9,11.63 84.5,13.23 95.91,13.23 96.85,14.17 96.85,15.87 95.05,17.67 95.05,18.31 v95.28,18.54
  Bottom 0.406: GSM_EXP.4 82.82,3.69 82.9,3.6 v82.9,3.59
G_I2C_SCL  (via drill 0.25)
  Top 0.406: v95.31,14.8 97.6,14.8 EC200_GSM.41
  V_LIPO 0.406: v80.34,3.74 80.34,11.55 83.62,14.83 95.31,14.83 v95.31,14.8
  Bottom 0.406: GSM_EXP.6 80.32,3.83 80.28,3.79 v80.34,3.74
G_I2C_SDA  (via drill 0.25)
  Top 0.406: EC200_GSM.42 97.6,16.03 v95.51,16.03
  V_LIPO 0.406: v95.51,16.03 95.51,15.78 96.14,15.15 96.14,14.46 95.62,13.93 83.94,13.93 81.56,11.55 81.56,3.68 v81.62,3.68
  Bottom 0.406: v81.62,3.68 81.57,3.74 GSM_EXP.5
G_USB_BOOT  (via drill 0.25)
  Top 0.406: EC200_GSM.115 71.03,6.42 71.35,6.1 72.59,6.1 v73.19,5.5 | GBOOT.2 51.67,12.85 J3.2 50.88,13.32 R71.2
  V_LIPO 0.406: v73.19,5.5 71.12,5.5 68.68,7.95 61.04,7.95 57.45,11.54 57.45,12.3 56.53,13.21 51.3,13.21 J3.2
  Bottom 0.406: v73.19,5.5 76.02,5.5 78.81,2.71 84.52,2.71 85.32,3.51 GSM_EXP.2
G_USB_N  (via drill 0.25)
  Top 0.2: 60.69,10.09 v60.65,10.13 | EC200_GSM.70 74.93,34.37 v75,34.3
  Top 0.305: QUEC_C.2 67.18,5.39 65.07,7.5 62.06,7.5 60.69,8.87 60.69,8.93 60.62,9 60.62,9.65 60.69,9.72 60.69,10.09
  V_LIPO 0.305: v60.65,10.13 60.65,18.08 75,32.43 v75,34.3
  Bottom 0.254: v60.65,10.13 60.71,10.07 60.71,8.96 61.31,8.36 D11.1
G_USB_P  (via drill 0.25)
  Top 0.2: EC200_GSM.69 76.23,34.58 v75.96,34.3
  Top 0.305: QUEC_C.3 67.78,4.56 67.78,5.64 65.32,8.11 62.63,8.11 v61.46,9.27
  V_LIPO 0.2: 75.96,34.09 75.96,34.18 v75.96,34.3
  V_LIPO 0.305: 75.96,34.18 75.96,32.5 61.46,18 61.46,17.04 61.45,17.03 61.45,16.38 61.46,16.37 v61.46,9.27
  Bottom 0.254: D10.1 61.46,13.66 v61.46,9.27
G_USB_VBUS  (via drill 0.25)
  Top 0.305: EC200_GSM.71 73.63,34.83 73.82,34.64 v73.82,34.41
  V_LIPO 0.305: v86.56,3.62 84.83,3.62 84.03,2.81 80.16,2.81 78.68,4.29 71.44,4.29 v68.42,7.32
  Bottom 0.254: 67.31,11.26 68.15,10.42 68.15,9.54 68.39,9.29 68.39,8.18
  Bottom 0.305: 67.31,11.26 67.13,11.43 67.13,27.41 70.21,30.49 | 68.42,7.2 v68.42,7.32 68.42,8.16 68.39,8.18
  Bottom 0.406: GSM_EXP.1 86.57,3.78 86.48,3.69 v86.56,3.62 | 70.21,30.49 70.21,30.65 70.22,30.66 70.22,31.93 70.61,32.33 70.61,32.86 70.79,33.04 72.84,33.04 73.82,34.02 v73.82,34.41
GND  (via drill 0.25, 0.35)
  Top 0.102: v65.78,41.81 66.94,41.81 67.62,41.13 70.34,41.13 C6.2 | U5.11 70.45,46.63 70.47,46.62 72.03,46.62 72.56,47.15 | R26.2 57.43,46.99 R30.2
  Top 0.152: U7.2 | R64.2 6.81,19.11 | C7.2 33.55,31.34 33.55,28.92 33.27,28.64 33.1,28.64 U4.2 U4.3 U4.8 | U6.8 U6.3
  Top 0.2: C26.2 8.45,23.49 C37.2 7.89,23.83 7.09,24.63 3.86,24.63 12V_LED.C | GSM_RST.1_1 61.5,34.59 60.73,33.82 v60.73,33.6 | QUEC_C.SH1 63.09,4.39 v62.66,4.83 | v61.48,1.02 61.48,1.12 63.31,1.12 QUEC_C.SH3 QUEC_C.SH6 71.63,3.69 QUEC_C.SH2 | EC200_GSM.19 72.11,8.15 72.11,9.31 71.55,9.87 70.13,9.87 v70.13,9.8 | EC200_GSM.96 81.92,28.54 v81.92,29.19 | v94.37,10.1 94.43,10.04 EC200_GSM.36 95.39,7.92 v96.32,7 | v96.32,7 | EC200_GSM.89 90.08,10.3 v90.07,10.29 | EC200_GSM.94 86.88,11.96 v85.26,10.34 | C14.1 81.51,42.13 C10.2 86,42.13 C11.2 88.32,42.06 D2.2 88.84,42.12 89.87,41.08 90.48,41.08 | 94.89,41.75 94.89,42.42 | 94.89,42.42 SIMCARD.G3 | 96.89,41.11 SIMCARD.G4 95.01,42.53 94.89,42.42
  Top 0.203: C17.2 88.87,49.88 89.92,50.93 90.89,50.93 92.06,49.76 93.76,49.76 v94.06,50.06 v94.07,50.06
  Top 0.254: RESET.2_1 RESET.2_2 96.79,56.49 96.79,55.63 96.89,55.53 SIMCARD.G2 96.89,54.62 96.46,54.2 v96.46,54.06 95.45,55.07 SIMCARD.G1 | SIMCARD.C5 93.8,52.83 v94.1,53.13 | D3.2 81.73,47.93 81.43,47.93 81.09,47.6 81.09,46.69 v81.73,46.05 | C20.1 69.77,54.34 56.92,54.34 55.92,53.34 C19.1 55.65,51.06 55.52,50.93 55.52,50.07 56.42,49.17 R30.2 | R29.2 72.56,47.15 70.21,44.8 66.41,44.8 65.96,44.35 65.96,42.69 67.59,41.06 68.22,41.06 69.28,42.12 C6.2 | v30.48,39.49 30.5,39.49 32.36,37.62 C23.2 31.91,35.87 C7.2 | U7.2 9.8,18.55 9.5,18.86 | R26.2 55.68,46.98 53.92,48.73 v53.92,48.82 | 72.23,36.32 71.66,35.75 71.66,32.73 71.33,32.4 68.04,32.4 67.91,32.53 67.91,33.82 68.22,34.13 v68.22,35.04 | 72.23,36.32 EC200_GSM.72 | EC200_GSM.108 72.32,33.13 72.32,36.98 72.23,36.89 72.23,36.32 | EC200_GSM.90 86.88,32.16 89,34.27 v89,34.33 | AE1.2 108.17,10.52 v108.12,10.46 108.12,9.47 AE1.3 104.94,9.05 v104.72,9.26
  Top 0.305: 9.8,18.55 v9.66,18.69 | v8.41,38.77 7.77,39.41 R53.1 | C31.2 14.24,41.59 v15.69,41.59 | C28.2 12.78,33.69 5V_REG_1.4 5V_REG_1.2 26.63,38.01 C30.2 | C26.2 10.85,25.58 9.98,26.45 v9.86,26.45 | U3.9 4.86,45.66 v4.49,46.03 | R54.2 2.62,46.17 v2.58,46.21 | v22.73,51.58 23.07,51.24 C8.2 25.37,51.91 C29.2 | R9.2 17.4,64.54 v18.13,64.54 | Q8.3 15.27,62.72 v15.74,62.25 | U6.3 U6.2 25.69,46.86 24.81,46.86 v24.81,46.87 v24.82,46.87 | R58.2 19.61,47.03 19.55,46.98 v19.57,46.96 | R8.2 27.46,57.34 28.43,56.37 v28.52,56.37 | POWER1.2 44.08,3.74 43.85,3.97 v43.85,4.05 | GSM_RST.1_2 61.31,31.12 v61.31,32.14 | EC200_GSM.8 EC200_GSM.9 67.33,21.27 68.03,21.98 73.49,21.98 EC200_GSM.110 | 77,24.56 v77.19,24.56 76.88,24.87 EC200_GSM.104 | C22.2 32.87,21.6 C24.2 32.87,20.06 32.87,18.77 v32.79,18.77 | 12V_LED.C 1.67,27.27 2.5,28.1 v2.5,28.18 | v38.42,64.17 38.42,64.12 37.88,64.12 5V_IN.C 34.54,63.48 5V_LED.C
  Top 0.406: U3.3 7.49,40.6 R53.1 | GSM_RST.1_1 61.5,37.32 GRST.2 | v53.34,58.76 53.3,58.81 J2.7 | R64.2 6.63,19.11 7.44,19.92 8.79,19.92 8.97,19.74 8.97,19.39 9.5,18.86 v9.66,18.69 | C19.1 53.92,53.34 v53.06,52.48 | RST2.2 35.43,5.15 v35.38,5.21 | C32.2 10.14,10.68 | EC200_GSM.52 EC200_GSM.54 | EC200_GSM.48 98.58,26.97 100.25,25.3 C40.2 | R71.1 46.58,15.65 v45.26,16.98
  Bottom 0.102: C35.1 66.7,39.06 67.45,39.81 67.45,41.12 67.31,41.27 66.27,41.27 65.84,41.7 | v65.78,41.81 65.78,41.75 65.84,41.7 | MICRO_SD1.MP4 64.92,47.09 64.92,46.61 65.32,46.21 67.07,46.21 68.41,47.55 70.84,47.55 70.93,47.47 70.93,46.44 70.84,46.35 69.29,46.35 67.39,44.46 67.39,42.8 66.99,42.41 66.55,42.41 65.84,41.7 | 59.27,2.85 JTAG.SH3
  Bottom 0.152: R18.1 67.64,9.51 67.64,9.33 67.85,9.12 67.85,7.74 67.71,7.61 67.71,7.02 68.12,6.61 68.71,6.61 70.13,8.03 v70.13,9.8
  Bottom 0.2: Q5.E 55.45,25 R13.1 55.45,20.85 55.95,20.35 55.95,20.11 55.99,20.07 v56.03,20.07 | U1.3 59.43,39.73 59.54,39.84 59.54,40.13 59.99,40.58 59.99,41.45 v59.41,42.02 | v60.73,33.6 61.94,33.6 C34.1 | D11.2 62.63,4.85 v62.66,4.83 | v70.13,9.8 71.74,11.41 R22.1 71.52,11.89 Q3.E | R24.1 77.11,24.03 77.11,24.49 v77.19,24.56 | R32.1 84.78,10.82 v85.26,10.34 | v94.07,50.06 94.12,50.11 97.62,50.11 v97.62,50.15 | X1.48 78.39,49.39 77.71,50.07 76.63,50.07 76.6,50.1 76.32,50.1 v76.28,50.06 | JTAG.B1_A12 51.32,7.61 JTAG.SH2 | JTAG.A1_B12 58.81,7.61 JTAG.SH1
  Bottom 0.254: X1.1 88.76,58.34 89.11,58.34 v89.11,58.29 | X1.45 81.68,46.1 v81.73,46.05 | R47.2 57.53,31.51 57.53,31.37 v57.57,31.37 | U1.3 57.47,39.73 56.97,39.23 U1.29 | C35.1 66.62,38.68 C36.1 | R66.2 71.25,34.53 70.32,33.59 69.44,33.59 68.17,34.87 68.17,34.99 v68.22,35.04 | X1.46 X1.47 | v89,34.33 86.6,36.73 R67.2 | v61.48,1.02 61.11,1.02 59.27,2.85
  Bottom 0.305: POWER.SH1 29.53,60.14 30.13,59.54 | 30.13,59.54 | 30.13,59.54 v30.17,59.58 | D4.2 55.3,12.58 v56.27,12.58 56.31,12.54 D8.2 | D9.2 58.66,13.44 v58.66,13.66 | v61.31,32.14 61.31,32.97 C34.1 64.3,33.83 C33.1 | Q4.E 70.02,23.9 70.97,24.85 72.18,24.85 72.33,24.7 72.33,23.52 R24.1 | D10.2 56.89,15.11 56.12,15.88 v56.12,15.93 56.12,19.98 v56.03,20.07 | GSM_EXP.7 78.57,6.11 78.57,6.56 78.43,6.7 78.43,10.13 v78.44,10.15 | Q2.E 63.23,9.89 v62.32,9.89 | MICRO_SD1.MP1 48.89,50.88 v49.56,51.55 | v49.56,51.55 | J1.1 26.33,6.63 33.95,6.63 35.19,5.39 | 35.19,5.39 v35.38,5.21 | 35.19,5.39 35.67,5.88 | v43.85,4.05 43.85,15.57 v45.26,16.98 | MICRO_SD1.6 53.61,48.51 v53.92,48.82 | v81.92,29.19 80.6,27.86 79.38,27.86 79.03,27.52 Q7.E
  Bottom 0.406: C1.2 71.31,13.8 Q3.E | X1.40 65.37,57.11 MICRO_SD1.MP3 63.26,57.76 63.11,57.91 v63.13,57.92 | U8.1 11.68,42.04 v8.41,38.77 | 35.67,5.88 36.65,5.88 36.9,6.12 39.23,6.12 41.3,4.05 v43.85,4.05 | JP1.4 3.95,8.69 H2.B2,8 | v45.26,16.98 48.82,20.54 U$86.16.GND
  other vias: 105.06,26.55 91.92,22.04 92.01,18.42 95.72,21.16 22.8,52.45 22.73,50.64 4.49,45.08 1.67,46.16 11.5,15.81 92.52,27.89 92.7,29.1 93.18,30.47 94.16,30 93.71,28.92 94.32,31.15 5,19.06 29.29,32.87 106.56,25.85 103.66,26.15 100.56,26.35 95.16,26.35 95.16,24.95 95.16,23.65 95.06,22.35 95.42,32.65 99.72,16.06 100.62,14.86 102.12,15.36 102.42,16.96 102.82,20.76 105.82,23.16 104.62,27.66 99.82,32.76 51.07,35.87
  pour GND (rank 2): 0.2,0.31 109.59,0.31 109.59,66.01 0.2,66.01
  pour Bottom (rank 2): 0.19,0.31 109.49,0.31 109.49,65.81 0.19,65.81
  pour Top (rank 2): 0.16,0.31 109.59,0.31 109.59,65.91 0.16,65.91
  pour Top: 13.1,18.15 13.1,17.85 9.8,17.85 8.9,18.75 8.9,19.15 8.8,19.25 8.8,19.65 8.7,19.75 7.5,19.75 7.1,19.35 7.1,18.45 7,18.35 6,18.35 5.8,18.55 5.8,19.75 6.2,20.15 9.1,20.15 10.5,18.75 11.3,18.75 11.9,18.15
  pour Top: 26.3,47.35 24.6,47.35 24.4,47.15 24.4,46.55 24.5,46.45 28.2,46.45 28.2,46.65 28.1,46.75 26.9,46.75
  pour Top: 16.3,61.75 16.3,62.35 15.6,63.05 14.1,63.05 14,62.95 14,62.45 14.1,62.35 14.2,62.25 15,62.25 15.4,61.85 15.4,61.65 16.2,61.65
GNSS_ANT
  Top 0.406: EC200_GSM.47 99.61,22.57 arc-45 R49.2 arc-45 100.3,21.99 C39.1
GSM_ANT
  Top 0.3: EC200_GSM.49 100.12,28.27 100.3,28.45 | C42.1 100.3,28.49 R68.2
  Top 0.406: 97.7,28.34 EC200_GSM.49 | 100.28,28.27 100.38,28.37 | 100.38,28.37 R68.2 | 100.3,28.45 100.38,28.37
GSM_RST  (via drill 0.25)
  Top 0.254: v59.67,29.63 59.67,30.7 GSM_RST.2_2
  Top 0.406: GRST.1 59.78,35.15 GSM_RST.2_1 GSM_RST.2_2 | EC200_GSM.20 73.63,6.24 74.02,5.85 74.02,3.72 73.42,3.11 73.39,3.11 v73.36,3.14
  GND 0.406: v73.36,3.14 70.84,3.14 67.51,6.47 67.51,7.36 63.36,11.5 63.36,11.83 64.57,13.04 64.57,15.09 64.09,15.57 62.26,15.57 v62.24,15.6
  Bottom 0.254: Q2.C 64.49,14.43 64.5,14.43 64.5,15.06 64.06,15.5 62.34,15.5 v62.24,15.6 56.43,21.41 56.43,25.59 59.64,28.8 59.64,29.6 v59.67,29.63
GSM_RST_O  (via drill 0.25)
  Top 0.254: v78.65,46.52 78.61,46.52 78.61,46.42 72.64,40.45 70.31,40.45 v68.76,38.9
  Bottom 0.254: R15.1 63.53,8.67 64.27,9.41 64.27,10.66 66.55,12.94 66.55,36.06 66.93,36.43 66.93,37.07 v68.76,38.9 | v78.65,46.52 79.01,46.17 80.47,46.17 81.4,45.25 82.06,45.25 82.54,45.72 82.54,46.35 84.41,48.22 X1.8
IO0  (via drill 0.25)
  Top 0.254: v90.15,62.86 91.02,63.73 FLASH.1_1
  Top 0.406: R43.1 98.94,63.73 FLASH.1_2 FLASH.1_1
  GND 0.254: v67.9,41.81 68.52,42.43 72.25,42.43 72.32,42.36 73.42,42.36 82.59,51.53 83.95,51.53 90.72,58.3 90.72,61.95 90.1,62.56 90.1,62.82 v90.15,62.86
  Bottom 0.254: v67.9,41.81 67.95,41.86 69.2,40.6 X1.27 69.52,40.09 69.52,38.59 69.08,38.15 69.02,38.15 67.48,36.61 67.48,36.2 67.32,36.04 67.32,33.18 T2.C
IO9  (via drill 0.35)
  V_LIPO 0.2: JP1.2 6.37,11.35 8.23,11.35 15.52,4.07 15.52,2.45 16.02,1.95 41.4,1.95 42.1,1.25 48.99,1.25 49.69,1.95 63.95,1.95 64.45,1.45 99.1,1.45 100.9,3.25 100.9,13.55 100.41,14.04 100.28,14.04 99.79,14.52 99.79,14.66 98.8,15.65 98.8,45.6 101.58,48.37 101.58,49.97 101.2,50.35 100.68,50.35 v100.39,50.64
  Bottom 0.15: X1.17 83.87,40 83.87,40.18 86.22,42.52 88.36,42.52 88.49,42.65 92.8,42.65 100.39,50.24 v100.39,50.64
IO10  (via drill 0.35)
  V_LIPO 0.2: JP1.3 2.83,12.35 4.95,12.35 6.25,11.05 7.1,11.05 7.12,11.03 8.1,11.03 15.2,3.93 15.2,2.32 15.89,1.63 41.22,1.63 42,0.85 49.02,0.85 49.8,1.63 63.82,1.63 64.32,1.13 99.23,1.13 101.22,3.12 101.22,13.68 100.56,14.34 100.4,14.34 100.09,14.64 100.09,14.8 99.12,15.77 99.12,44.74 99.1,44.77 99.1,45.29 99.12,45.31 99.12,45.47 101.89,48.24 101.89,50.1 101.42,50.57 101.42,51.1 v101.14,51.38
  Bottom 0.15: v101.14,51.38 100.94,51.19 99.7,51.19 95.86,47.35 95.86,46.54 93.43,44.11 90.55,44.11 88.36,46.31 86.71,46.31 86.36,45.96 85.4,45.96 84.65,45.2 84.65,42.22 82.6,40.18 82.6,40 X1.18
IO45
  Bottom 0.406: R66.1 71.84,39.32 X1.26
IO46
  Bottom 0.254: R67.1 84.57,39.28 X1.16
KDK
  cutout Bottom: 109.5,56.55 102.3,56.55 102.3,35.45 104,33.55 105.4,32.45 109.4,32.45 109.5,56.35
L_NRESET  (via drill 0.25)
  GND 0.254: v50.73,23.66 52.85,25.77 52.85,28.47 65.12,40.74 73.89,40.74 v73.89,40.75
  Bottom 0.152: U$86.14.RST 48.92,26.27 49.89,25.3 50.01,25.3 51.9,23.41 51.9,20.14 52.73,19.31 52.73,18.09 51.9,17.26 R75.1 51.7,16.8 R76.1
  Bottom 0.254: 50.7,23.66 v50.73,23.66 | v73.89,40.75 73.95,40.75 74.34,40.36 X1.24
  Bottom 0.406: 48.92,26.27 49.77,25.42 50.06,25.42 50.73,24.75 v50.73,23.66
L_NSS  (via drill 0.25, 0.35)
  V_LIPO 0.406: v85.15,43.34 85.15,43.37 83.83,43.37 83.12,44.09 79.74,44.09 70.44,53.38 64.12,53.38 63.6,52.87 63.6,23.31 61.55,21.25 60.86,21.25 60.55,21.56 v59.65,21.56 57.5,19.41 v57.5,19.05
  Bottom 0.406: v85.15,43.34 87.33,43.34 X1.12 | U$86.13.NSS 49.77,27.42 50.06,27.42 52.41,25.08 52.41,24.14 52.68,23.86 53.93,23.86 54.65,23.15 54.65,16.43 56.47,14.61 58.52,14.61 58.82,14.9 58.82,15.32 57.5,16.63 v57.5,19.05
MAIN_CTS  (via drill 0.25)
  Top 0.305: U5.4 65.66,50.53 v65.88,50.76
  Top 0.406: EC200_GSM.64 82.75,36.4 v82.75,34.2
  V_LIPO 0.406: v65.88,50.76 65.89,50.75 69.83,50.75 82.75,37.83 v82.75,34.2
MAIN_DCD  (via drill 0.25)
  Top 0.305: U5.3 64.84,51.19 v65.25,51.59
  Top 0.406: EC200_GSM.63 84.03,34.43 v84.13,34.34
  V_LIPO 0.406: v84.13,34.34 84.13,37.7 82.34,39.49 82.19,39.64 70.24,51.59 v65.25,51.59
MAIN_DTR  (via drill 0.25)
  Top 0.305: U5.6 65.29,49.23 v65.67,48.85
  Top 0.406: EC200_GSM.66 80.13,34.38 v80.09,34.34
  V_LIPO 0.406: v80.09,34.34 80.09,37.68 68.88,48.89 65.67,48.89 v65.67,48.85
MAIN_RI  (via drill 0.35)
  Top 0.254: EC200_GSM.62 85.33,34.3 v85.32,34.29
  Top 0.305: U5.1 64.46,52.48
  Top 0.406: EC200_GSM.62 85.32,36.43 | 64.46,52.48 v64.48,52.5
  V_LIPO 0.406: v64.48,52.5 65.19,52.5 65.27,52.42 70.41,52.42 85.32,37.51 v85.32,34.29
  Bottom 0.254: R34.1 78.86,23.37 | v85.32,34.29 83.3,32.26 79.82,32.26 79.69,32.13 79.69,30.34
  Bottom 0.305: 79.69,30.34 77.87,28.52 77.87,24.99 78.28,24.58 78.28,23.91 78.43,23.76 78.46,23.76 78.86,23.37
MAIN_RTS  (via drill 0.25)
  Top 0.305: U5.5 66.17,49.88
  Top 0.406: EC200_GSM.65 81.43,34.45 81.42,34.44 v81.44,34.43 | 66.17,49.88 v66.25,49.81
  V_LIPO 0.406: v81.44,34.43 81.44,37.55 81.35,37.63 81.35,37.68 69.22,49.81 v66.26,49.81 v66.25,49.81
MAIN_RXD  (via drill 0.25)
  Top 0.305: U5.8 63.78,47.94
  Top 0.406: 63.78,47.94 64.83,46.88 v65.6,46.88 v65.6,46.89 | EC200_GSM.68 77.53,34.41 v77.52,34.39
  V_LIPO 0.406: v65.6,46.89 65.68,46.96 68.81,46.96 77.52,38.25 v77.52,34.39
MAIN_TXD  (via drill 0.25)
  Top 0.305: U5.7 63.5,48.59 63.51,48.59 64.83,48.59 65.35,48.07 65.88,48.07 v66.12,47.83
  Top 0.406: EC200_GSM.67 78.85,36.4 78.85,34.35 v78.88,34.32